# Altium schematic sheet INTERFACE.SchDoc
size A4; SheetNumber: 3; SheetTotal: 3
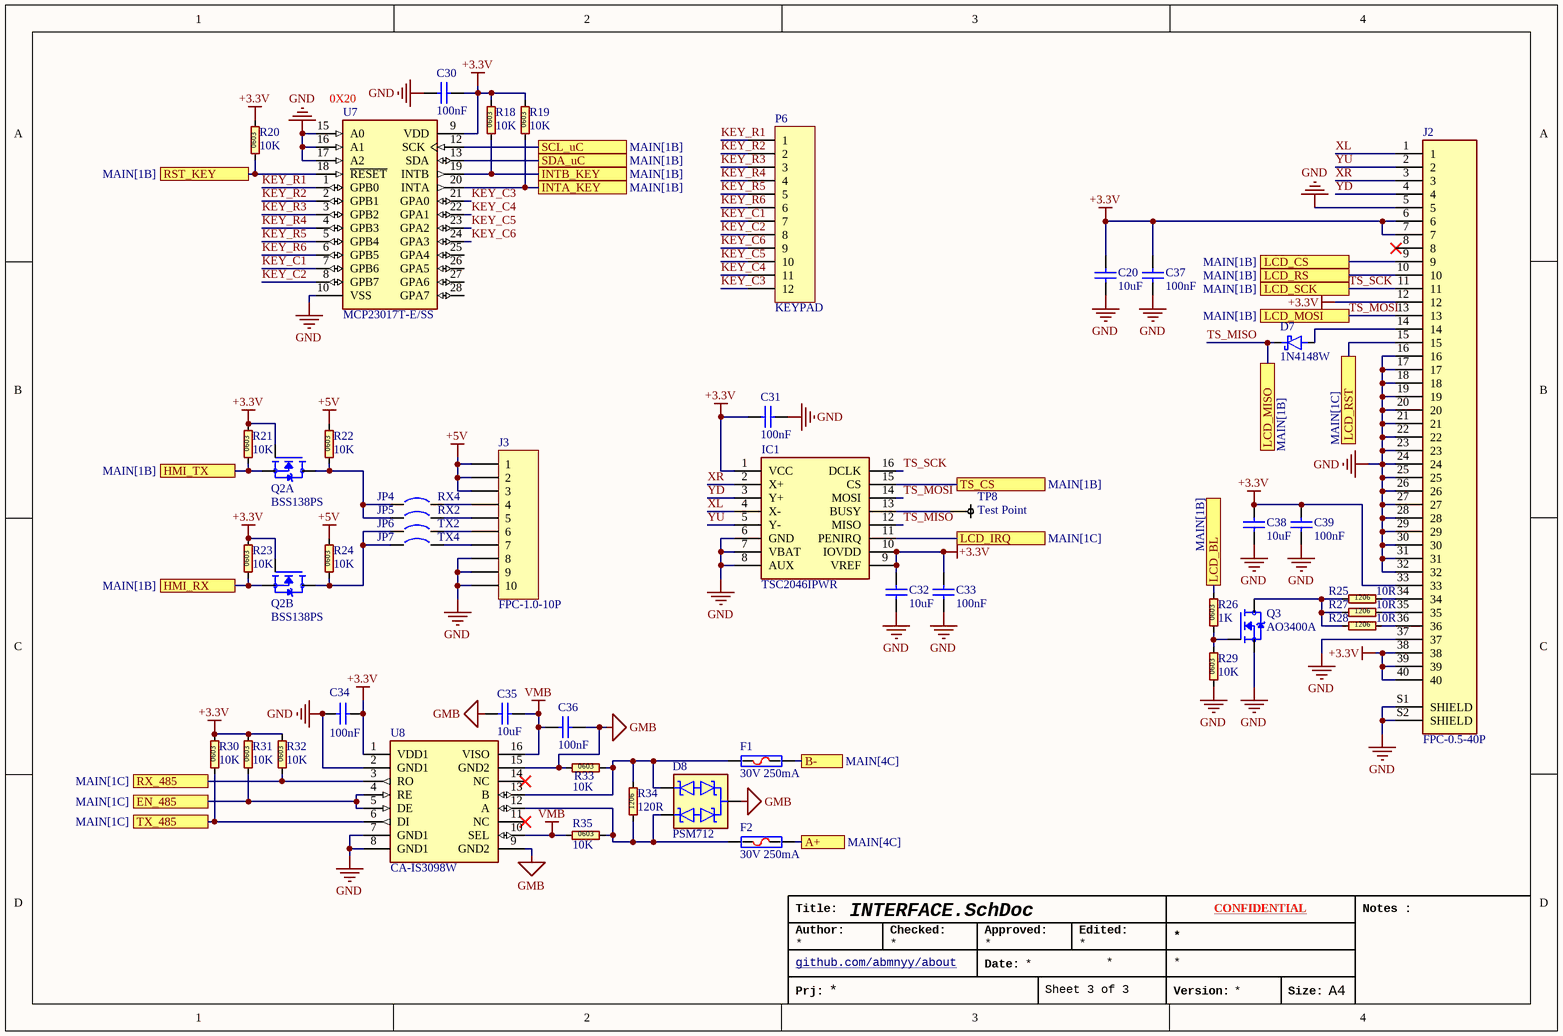
[diagram p0: INTERFACE.SchDoc]

## Parts
C20  10uF  [C0603]
C30  100nF  [C0603]
C31  100nF  [C0603]
C32  10uF  [C0603]
C33  100nF  [C0603]
C34  100nF  [C0603]
C35  10uF  [C0603]
C36  100nF  [C0603]
C37  100nF  [C0603]
C38  10uF  [C0603]
C39  100nF  [C0603]
D7  1N4148W  [SOD-123F]
D8  PSM712  [SOT-23-3]
F1  30V 250mA  [PPTC-1206]
F2  30V 250mA  [PPTC-1206]
IC1  TSC2046IPWR  [TSSOP-16]
J2  FPC-0.5-40P  [FPC_0.5_40P - TOP CONTACT - duplicate]
J3  FPC-1.0-10P  [FPC_1.0_10P - BOTTOM CONTACT]
JP4  RX4  [SB_STM]
JP5  RX2  [SB_STM]
JP6  TX2  [SB_STM]
JP7  TX4  [SB_STM]
P6  KEYPAD  [HDR-12P-2.54mm]
Q2  BSS138PS  [SOT-363]  (parts A,B of 2)
Q3  AO3400A  [SOT-23-3]
R18  10K  [R0603]
R19  10K  [R0603]
R20  10K  [R0603]
R21  10K  [R0603]
R22  10K  [R0603]
R23  10K  [R0603]
R24  10K  [R0603]
R25  10R  [R1206]
R26  1K  [R0603]
R27  10R  [R1206]
R28  10R  [R1206]
R29  10K  [R0603]
R30  10K  [R0603]
R31  10K  [R0603]
R32  10K  [R0603]
R33  10K  [R0603]
R34  120R  [R1206]
R35  10K  [R0603]
TP8  Test Point  [PAD]
U7  MCP23017T-E/SS  [SSOP-28]
U8  CA-IS3098W  [SOIC-16-WIDE]

## Ports
A+ (see MAIN[4C]), B- (see MAIN[4C]), EN_485 (see MAIN[1C]), HMI_RX (see MAIN[1B]), HMI_TX (see MAIN[1B]), INTA_KEY (see MAIN[1B]), INTB_KEY (see MAIN[1B]), LCD_BL (see MAIN[1B]), LCD_CS (see MAIN[1B]), LCD_IRQ (see MAIN[1C]), LCD_MISO (see MAIN[1B]), LCD_MOSI (see MAIN[1B]), LCD_RS (see MAIN[1B]), LCD_RST (see MAIN[1C]), LCD_SCK (see MAIN[1B]), RST_KEY (see MAIN[1B]), RX_485 (see MAIN[1C]), SCL_uC (see MAIN[1B]), SDA_uC (see MAIN[1B]), TS_CS (see MAIN[1B]), TX_485 (see MAIN[1C])

## Nets
+3.3V: C20.1 C30.2 C31.2 C32.1 C33.2 C34.2 C37.2 C38.1 C39.2 IC1.1(VCC) IC1.9(VREF) IC1.10(IOVDD) J2.6 J2.7 J2.12 J2.33 J2.38 J2.39 J2.40 Q2.2(G1) Q2.5(G2) R18.2 R19.2 R20.2 R21.2 R23.2 R30.2 R31.2 R32.2 U7.9(VDD) U8.1(VDD1)
+5V: J3.1 J3.2 J3.3 R22.2 R24.2
GMB: C35.2 C36.2 D8.3 R33.1 U8.9(GND2) U8.15(GND2)
GND: C20.2 C30.1 C31.1 C32.2 C33.1 C34.1 C37.1 C38.2 C39.1 IC1.6(GND) IC1.7(VBAT) IC1.8(AUX) J2.5 J2.16 J2.17 J2.18 J2.19 J2.20 J2.21 J2.22 J2.23 J2.24 J2.25 J2.26 J2.27 J2.28 J2.29 J2.30 J2.31 J2.32 J2.37 J2.S1(SHIELD) J2.S2(SHIELD) J3.8 J3.9 J3.10 Q3.2(S) R29.1 U7.10(VSS) U7.15(A0) U7.16(A1) U7.17(A2) U8.2(GND1) U8.7(GND1) U8.8(GND1)
VMB: C35.1 C36.1 R35.1 U8.10(SEL) U8.16(VISO)
A+: F2.2 ; port A+
B-: F1.2 ; port B-
EN_485: R31.1 U8.4(RE) U8.5(DE) ; port EN_485
HMI_RX: Q2.4(S2) R23.1 ; port HMI_RX
HMI_TX: Q2.1(S1) R21.1 ; port HMI_TX
INTA_KEY: R19.1 U7.20(INTA) ; port INTA_KEY
INTB_KEY: R18.1 U7.19(INTB) ; port INTB_KEY
KEY_C1: P6.7 U7.7(GPB6)
KEY_C2: P6.8 U7.8(GPB7)
KEY_C3: P6.12 U7.21(GPA0)
KEY_C4: P6.11 U7.22(GPA1)
KEY_C5: P6.10 U7.23(GPA2)
KEY_C6: P6.9 U7.24(GPA3)
KEY_R1: P6.1 U7.1(GPB0)
KEY_R2: P6.2 U7.2(GPB1)
KEY_R3: P6.3 U7.3(GPB2)
KEY_R4: P6.4 U7.4(GPB3)
KEY_R5: P6.5 U7.5(GPB4)
KEY_R6: P6.6 U7.6(GPB5)
LCD_BL: R26.2 ; port LCD_BL
LCD_CS: J2.9 ; port LCD_CS
LCD_IRQ: IC1.11(PENIRQ) ; port LCD_IRQ
LCD_RS: J2.10 ; port LCD_RS
LCD_RST: J2.15 ; port LCD_RST
RST_KEY: R20.1 U7.18(~{RESET}) ; port RST_KEY
RX_485: R32.1 U8.3(RO) ; port RX_485
SCL_uC: U7.12(SCK) ; port SCL_uC
SDA_uC: U7.13(SDA) ; port SDA_uC
TS_CS: IC1.15(CS) ; port TS_CS
TS_MISO: D7.K IC1.12(MISO) ; port LCD_MISO
TS_MOSI: IC1.14(MOSI) J2.13 ; port LCD_MOSI
TS_SCK: IC1.16(DCLK) J2.11 ; port LCD_SCK
TX_485: R30.1 U8.6(DI) ; port TX_485
XL: IC1.4(X-) J2.1
XR: IC1.2(X+) J2.3
YD: IC1.3(Y+) J2.4
YU: IC1.5(Y-) J2.2
NetD7_A: D7.A J2.14
NetD8_1: D8.1 F1.1 R33.2 R34.2 U8.13(B)
NetD8_2: D8.2 F2.1 R34.1 R35.2 U8.12(A)
NetIC1_13: IC1.13(BUSY) TP8.1
NetJ2_34: J2.34 R25.2
NetJ2_35: J2.35 R27.2
NetJ2_36: J2.36 R28.2
NetJ3_4: J3.4 JP4.2
NetJ3_5: J3.5 JP5.2
NetJ3_6: J3.6 JP6.2
NetJ3_7: J3.7 JP7.2
NetJP4_1: JP4.1 JP5.1 Q2.6(D1) R22.1
NetJP6_1: JP6.1 JP7.1 Q2.3(D2) R24.1
NetQ3_1: Q3.1(G) R26.1 R29.2
NetQ3_3: Q3.3(D) R25.1 R27.1 R28.1

Not connected (* = marked no-connect by the designer): J2 8*; U7 25(GPA4) 26(GPA5) 27(GPA6) 28(GPA7); U8 11(NC)* 14(NC)*

## Notes on the sheet
- (near U7) 0X20
- Title:
- Author:
- Checked:
- Approved:
- Edited:
- CONFIDENTIAL
- Notes :
- Prj:
- github.com/abmnyy/about <https://github.com/abmnyy/about>
- Date:
- Version:
- Size:
- A4
- (in symbol Resistor 0603 (Inch)) 0603
- (in symbol Resistor 1206 (Inch)) 1206

## Library data of the parts
C20 C30-C39 = Capacitor 0603 (Inch): 0603 SMD Non-Polarity Capacitor; MFR.Part #: *; LCSC Part #: *; ComponentLink1Description: Datasheet; ComponentLink1URL: *
D7 = 1N4148W: 75V Independent 1V@50mA 4ns 150mA SOD-123 Switching Diodes ROHS; MFR.Part #: 1N4148W; LCSC Part #: C81598; ComponentLink1Description: Datasheet; ComponentLink1URL: https://www.lcsc.com/datasheet/C81598.pdf
D8 = PSM712: 31V, 19V Clamp 19A (8/20µs) Ipp Tvs Diode; MFR.Part #: PSM712-LF-T7; LCSC Part #: C2687124; ComponentLink1Description: Datasheet; ComponentLink1URL: https://lcsc.com/datasheet/lcsc_datasheet_2311091738_UMW-Youtai-Semiconductor-Co---Ltd--PSM712-LF-T7_C2687124.pdf
F1 F2 = PPTC 1206: PPTC RESET FUSE; MFR.Part #: BSMD1206-010-30V; LCSC Part #: C5373977; ComponentLink1Description: Datasheet
  F1: ComponentLink1URL: https://www.lcsc.com/datasheet/C5373977.pdf
  F2: ComponentLink1URL: *
IC1 = TSC2046IPWR: 12 2V~5.25V TSSOP-16 Touch Screen Controllers ROHS; MFR.Part #: TSC2046IPWR; LCSC Part #: C8954; ComponentLink1Description: Datasheet; ComponentLink1URL: https://www.lcsc.com/datasheet/C8954.pdf
J2 = FPC-0.5-40P: Connector: FFC / FPC; horizontal; PIN: 40; ZIF, top contacts; SMT; MFR.Part #: AFC07-S40ECA-00; LCSC Part #: C262648; ComponentLink1Description: Datasheet; ComponentLink1URL: *
J3 = FPC-1.0-10P: Connector: FFC / FPC; horizontal; PIN: 10; ZIF; MFR.Part #: BX-FPC1.0-2H10PX; LCSC Part #: C18077668
JP4-JP7 = Jumper Solder: Jumper Solder Pad; Published: 24-Mar-1999; Revision: July-2002: Re-released for DXP Platform.; Publisher: Altium Limited
P6 = Header 12: Header, 12-Pin; LatestRevisionDate: 17-Jul-2002; LatestRevisionNote: Re-released for DXP Platform.; Publisher: Altium Limited
Q2 = BSS138PS: 60 V, 320 mA dual N-channel Trench MOSFET; MFR.Part #: BSS138PS,115; LCSC Part #: C193381; ComponentLink1Description: Datasheet; ComponentLink1URL: https://www.lcsc.com/datasheet/lcsc_datasheet_2410121736_Nexperia-BSS138PS-115_C193381.pdf
Q3 = AO3400A: N-Channel 30 V 5.8A 1.4W; MFR.Part #: AO3400A; LCSC Part #: C20917; ComponentLink1Description: Datasheet; ComponentLink1URL: https://www.lcsc.com/datasheet/lcsc_datasheet_2410121838_Alpha---Omega-Semicon-AO3400A_C20917.pdf
R18-R24 R29-R33 R35 = Resistor 0603 (Inch): 0603 SMD Thick Resistor; MFR.Part #: *; LCSC Part #: *; ComponentLink1Description: Datasheet; ComponentLink1URL: *
R25 R27 R28 = Resistor 1206 (Inch): 1206 SMD Thick Resistor; MFR.Part #: RC1206FR-0710RL; LCSC Part #: C108080; ComponentLink1Description: Datasheet
  R25: ComponentLink1URL: https://www.lcsc.com/datasheet/C108080.pdf
  R27 R28: ComponentLink1URL: *
R26 = Resistor 0603 (Inch): 0603 SMD Thick Resistor; MFR.Part #: RC0603JR-071KL; LCSC Part #: C14676; ComponentLink1Description: Datasheet; ComponentLink1URL: *
R34 = Resistor 1206 (Inch): 1206 SMD Thick Resistor; MFR.Part #: RC1206FR-07120RL; LCSC Part #: C114928; ComponentLink1Description: Datasheet; ComponentLink1URL: *
TP8 = Test Point: Thick Pad
U7 = MCP23017T-E/SS: 16-bit Input/Output Expander, I2C interface, Pb-free28 SSOP .209in T/R | Microchip Technology Inc. MCP23017T-E/SS; MFR.Part #: MCP23017T-E/SS; LCSC Part #: C558584; ComponentLink1Description: Datasheet; ComponentLink1URL: https://www.lcsc.com/datasheet/C558584.pdf
U8 = CA-IS3098W: SOIC16-WB(W) Isolated RS-485/422 Transceivers with power, 20Mbps; MFR.Part #: CA-IS3098W; LCSC Part #: C7422557; ComponentLink1Description: Datasheet; ComponentLink1URL: https://www.lcsc.com/datasheet/C7422557.pdf